# Altium schematic sheet powerpump.SchDoc
size A4
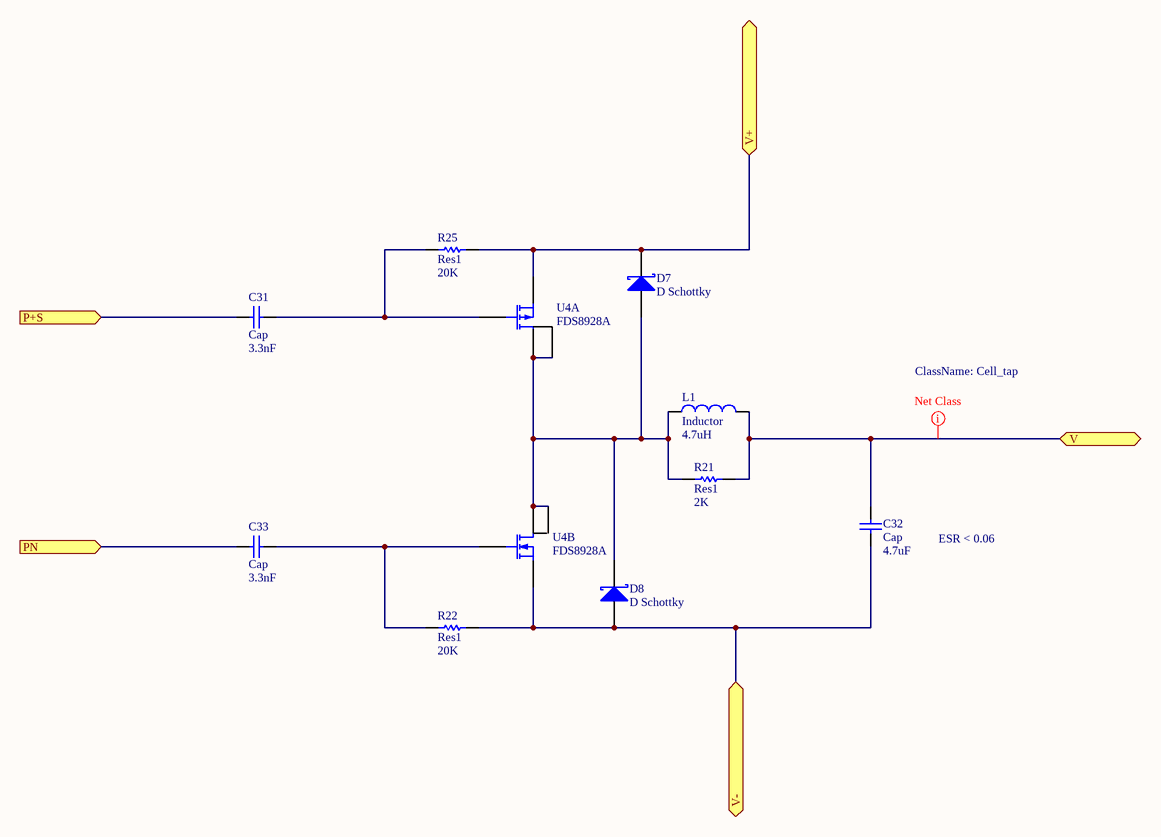
[diagram p0: powerpump.SchDoc]

## Parts
C31  Cap  value 3.3nF  [C0805]
C32  Cap  value 4.7uF  [C0805]
C33  Cap  value 3.3nF  [C0805]
D7  D Schottky  [B0520LW]
D8  D Schottky  [B0520LW]
L1  Inductor  value 4.7uH  [LQH44P]
R21  Res1  value 2K  [R0603]
R22  Res1  value 20K  [R0603]
R25  Res1  value 20K  [R0603]
U4  FDS8928A  [FDS8928A]  (parts A,B of 2)

## Ports
P+S (in), PN (in), V, V+, V-

## Nets
P+S: C31.1 ; port P+S
PN: C33.1 ; port PN
V: C32.1 L1.2 R21.2 ; port V
V+: D7.2(K) R25.2 U4.3(S_P) ; port V+
V-: C32.2 D8.1(A) R22.2 U4.1(S_N) ; port V-
NetC31_2: C31.2 R25.1 U4.4(G_P)
NetC33_2: C33.2 R22.1 U4.2(G_N)
NetD7_1: D7.1(A) D8.2(K) L1.1 R21.1 U4.5(D_P) U4.6(D_N) U4.7(D_N) U4.8(D_N)

## Layout directives
net class Cell_tap: V

## Notes on the sheet
- ESR < 0.06

## Library data of the parts
C31-C33 = Cap: Capacitor; Published: 8-Jun-2000; LatestRevisionDate: 17-Jul-2002; LatestRevisionNote: Re-released for DXP Platform.; PackageReference: RAD-0.3; Publisher: Altium Limited; ClassName: PowerPump
  C31 C33: farnell: 1759239
  C32: farnell: 1845746
D7 D8 = D Schottky: Schottky Diode; pin to pad: 1>A 2>K; Published: 8-Jun-2000; LatestRevisionDate: 17-Jul-2002; LatestRevisionNote: Re-released for DXP Platform.; PackageReference: SMB; Publisher: Altium Limited; Code_JEDEC: DO-214-AA; farnell: 1863141; ClassName: PowerPump
L1 = Inductor: Code_IEC: 1005; Published: 8-Jun-2000; LatestRevisionDate: 29-May-2009; LatestRevisionNote: IPC-7351 Footprint Added.; PackageReference: 0402-A; Publisher: Altium Limited; PackageDescription: Chip Inductor; Code_JEITA: 0402; farnell: 1782798; ClassName: PowerPump
R21 R22 R25 = Res1: Resistor; Published: 8-Jun-2000; LatestRevisionDate: 17-Jul-2002; LatestRevisionNote: Re-released for DXP Platform.; PackageReference: AXIAL-0.3; Publisher: Altium Limited; ClassName: PowerPump
  R21: farnell: 2059609
  R22 R25: farnell: 2059636
U4 = FDS8928A: MOSFET, DUAL, NP, SMD, 8-SOIC; farnell: 1467988